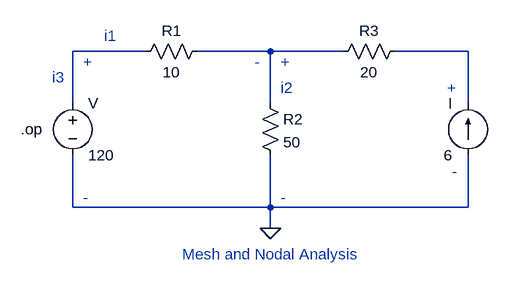
[diagram p0: schematic Mesh_and_Nodal_Analysis.asc]
Mesh_and_Nodal_Analysis.asc, the LTspice schematic file:
Version 4
SHEET 1 880 680
WIRE 176 224 64 224
WIRE 368 224 256 224
WIRE 480 224 368 224
WIRE 672 224 560 224
WIRE 64 304 64 224
WIRE 368 304 368 224
WIRE 672 304 672 224
WIRE 64 464 64 384
WIRE 368 464 368 384
WIRE 368 464 64 464
WIRE 672 464 672 384
WIRE 672 464 368 464
WIRE 368 496 368 464
FLAG 368 496 0
SYMBOL Res 352 288 R0
SYMATTR InstName R2
SYMATTR Value 50
SYMBOL Res 464 240 R270
WINDOW 0 32 56 VTop 2
WINDOW 3 0 56 VBottom 2
SYMATTR InstName R3
SYMATTR Value 20
SYMBOL Voltage 64 288 R0
SYMATTR InstName V
SYMATTR Value 120
SYMBOL current 672 384 R180
WINDOW 0 24 80 Left 2
WINDOW 3 24 0 Left 2
SYMATTR InstName I
SYMATTR Value 6
SYMBOL Res 272 208 R90
WINDOW 0 0 56 VBottom 2
WINDOW 3 32 56 VTop 2
SYMATTR InstName R1
SYMATTR Value 10
TEXT 80 240 Left 2 ;+
TEXT 384 240 Left 2 ;+
TEXT 640 280 Left 2 ;+
TEXT 344 240 Left 2 ;-
TEXT 384 448 Left 2 ;-
TEXT 648 408 Left 2 ;-
TEXT 80 448 Left 2 ;-
TEXT 32 264 Left 2 ;i3
TEXT 112 200 Left 2 ;i1
TEXT 384 280 Left 2 ;i2
TEXT 232 536 Left 2 ;Mesh and Nodal Analysis
TEXT -16 344 Left 2 !.op

The netlist it stands for:
* Mesh_and_Nodal_Analysis.asc
R2 N002 0 50
R3 N002 N003 20
V N001 0 120
I 0 N003 6
R1 N002 N001 10
* +
* +
* +
* -
* -
* -
* -
* i3
* i1
* i2
* Mesh and Nodal Analysis
.op
.backanno
.end